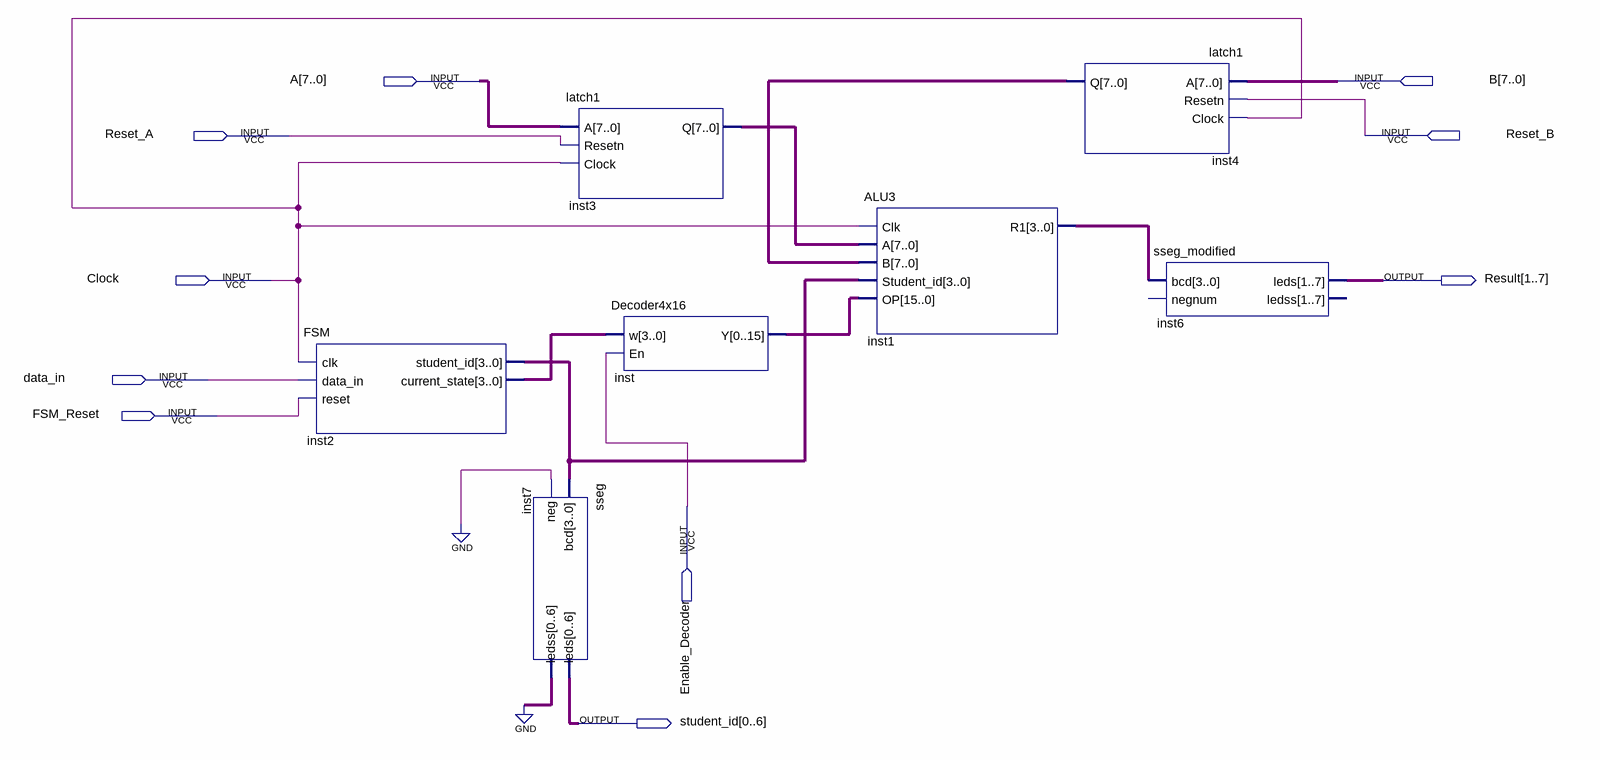
[diagram p0: schematic sheet]
// Quartus schematic alu_circuit3.bdf as structural Verilog: 7 symbols, 10 pins
module alu_circuit3 (
  input  [7:0] A,
  input  [7:0] B,
  input  Reset_A,
  input  Reset_B,
  input  Clock,
  input  data_in,
  input  FSM_Reset,
  input  Enable_Decoder,
  output [1:7] Result,
  output [0:6] student_id
);

  wire [3:0] inst1_r1, inst2_current_state, inst2_student_id;
  wire [6:0] inst7_ledss;
  wire [7:0] inst3_q, inst4_q;
  wire [15:0] inst_y;

  FSM inst2 (
    .clk(Clock), .data_in(data_in), .reset(FSM_Reset), .student_id(inst2_student_id),
    .current_state(inst2_current_state));
  sseg inst7 (.bcd(inst2_student_id), .neg(1'b0), .leds(student_id), .ledss(inst7_ledss));
  latch1 inst3 (.A(A), .Resetn(Reset_A), .Clock(Clock), .Q(inst3_q));
  Decoder4x16 inst (.w(inst2_current_state), .En(Enable_Decoder), .Y(inst_y));
  ALU3 inst1 (.Clk(Clock), .A(inst3_q), .B(inst4_q), .Student_id(inst2_student_id), .OP(inst_y), .R1(inst1_r1));
  latch1 inst4 (.A(B), .Resetn(Reset_B), .Clock(Clock), .Q(inst4_q));
  sseg_modified inst6 (.bcd(inst1_r1), .leds(Result));  // open: negnum, ledss
  // also tied to GND on the sheet: {inst7_ledss[0], inst7_ledss[1], inst7_ledss[2], inst7_ledss[3], inst7_ledss[4], inst7_ledss[5], inst7_ledss[6]}
endmodule
